# Altium schematic sheet Sallen-Key Filter.SchDoc
size A
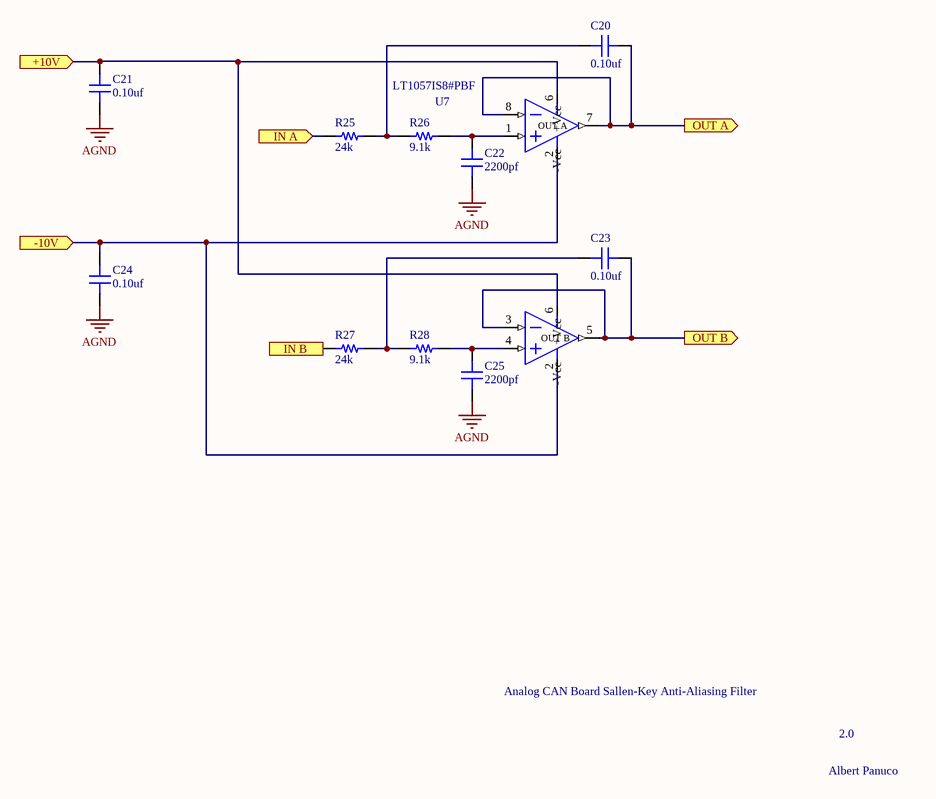
[diagram p0: Sallen-Key Filter.SchDoc]

## Parts
C20  value 0.10uf  [CAP 0805/2012]  (hidden comment: Capacitor MLCC 0.10uf 25V CAP 0805/2012)
C21  value 0.10uf  [CAP 0805/2012]  (hidden comment: Capacitor MLCC 0.10uf 25V CAP 0805/2012)
C22  value 2200pf  [CAP 0805/2012]  (hidden comment: Capacitor MLCC 2200pf 25V CAP 0805/2012)
C23  value 0.10uf  [CAP 0805/2012]  (hidden comment: Capacitor MLCC 0.10uf 25V CAP 0805/2012)
C24  value 0.10uf  [CAP 0805/2012]  (hidden comment: Capacitor MLCC 0.10uf 25V CAP 0805/2012)
C25  value 2200pf  [CAP 0805/2012]  (hidden comment: Capacitor MLCC 2200pf 25V CAP 0805/2012)
R25  value 24k  [RES 0805/2012]  (hidden comment: Resistor 24k 0805 1/10W 1%)
R26  value 9.1k  [RES 0805/2012]  (hidden comment: Resistor 9.1k 0805 1/10W 1%)
R27  value 24k  [RES 0805/2012]  (hidden comment: Resistor 24k 0805 1/10W 1%)
R28  value 9.1k  [RES 0805/2012]  (hidden comment: Resistor 9.1k 0805 1/10W 1%)
U7  LT1057IS8#PBF  [SOIC-8]

## Ports
+10V (in), -10V (in), IN A (in), IN B (in), OUT A (out), OUT B (out)

## Nets
AGND: C21.1 C22.1 C24.2 C25.1
+10V: C21.2 U7.6(+Vcc) ; port +10V
-10V: C24.1 U7.2(-Vcc) ; port -10V
IN A: R25.1 ; port IN A
IN B: R27.1 ; port IN B
OUT A: C20.2 U7.7(OUT_A) U7.8(-IN_A) ; port OUT A
OUT B: C23.2 U7.3(+IN_B) U7.5(OUT_B) ; port OUT B
NetC20_1: C20.1 R25.2 R26.1
NetC22_2: C22.2 R26.2 U7.1(+IN_A)
NetC23_1: C23.1 R27.2 R28.1
NetC25_2: C25.2 R28.2 U7.4(+IN_B)

## Notes on the sheet
- Analog CAN Board Sallen-Key Anti-Aliasing Filter
- 2.0
- Albert Panuco

## Library data of the parts
C20 C21 C23 C24 = 703: Manufacturer_id: 1; idCapacitor: 703; Name: Cap_0.10uf_25V_CAP 0805/2012; Dielectric: Ceramic; Created_By: Nick Mah; Drawer_id: 1; Voltage_Rating: 25V; Package: CAP 0805/2012; Created_Date: 10/20/2018
C22 C25 = 681: Manufacturer_id: 1; idCapacitor: 681; Name: Cap_2200pf_25V_CAP 0805/2012; Dielectric: Ceramic; Created_By: Nick Mah; Drawer_id: 1; Voltage_Rating: 25V; Package: CAP 0805/2012; Created_Date: 10/20/2018
R25 R27 = 538: Manufacturer_id: 1; idResistor: 538; Name: Res_24k_0805_1/10W_1%; Created_By: Nick Mah; Supplier 1: Digi-Key; Drawer_id: 1; Tolerance: 1%; Power: 1/10W; Package: 0805; ComponentLink1Description: Datasheet; Created_Date: 2018-10-20
R26 R28 = 528: Manufacturer_id: 1; idResistor: 528; Name: Res_9.1k_0805_1/10W_1%; Created_By: Nick Mah; Supplier 1: Digi-Key; Drawer_id: 1; Tolerance: 1%; Power: 1/10W; Package: 0805; ComponentLink1Description: Datasheet; Created_Date: 2018-10-20
U7 = 1: IC OPAMP JFET 5MHZ 8SO; idOp_Amp: 1; Num_Circuits: 2; Slew_Rate: 13 V/us; Supply_Voltage: 10~18; Created_By: Albert Panuco; Manufacturer_id: 1; Drawer_id: 1; Name: OPAMP JFET; Amplifier_Type: JFET; GBW: 5MHz; Package: 8-SO; MfrPartNo: LT1057IS8#PBF; Link: https://www.digikey.com/product-detail/en/linear-technology-analog-devices/LT1057IS8-PBF/LT1057IS8-PBF-ND/961410; Supplier1: Digikey; Supplier1PartNo: LT1057IS8#PBF-ND